# EAGLE design YonderDeep (EAGLE 9.3.2)

## Sheet 1 of 4
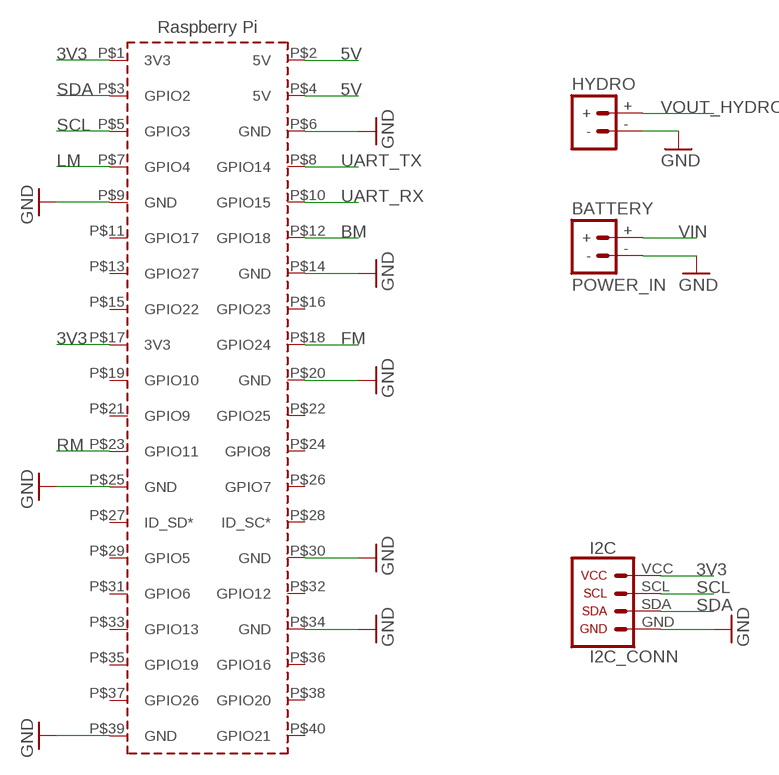
[diagram p0: schematic, sheet 1]

### Parts
BATTERY  POWER_IN  [TERMINAL]
HYDRO  POWER_IN  [TERMINAL]
I2C  I2C_CONN  [1X04]
PCB1  RPI3  [RPI3_CONN_ONLY]

### Nets
3V3: I2C.VCC PCB1.P$1(3V3) PCB1.P$17(3V3) ; also sheet 3
5V: PCB1.P$2(5V) PCB1.P$4(5V) ; also sheet 3,4
BM: PCB1.P$12(GPIO18) ; also sheet 2
FM: PCB1.P$18(GPIO24) ; also sheet 2
GND: BATTERY.- HYDRO.- I2C.GND PCB1.P$6(GND) PCB1.P$9(GND) PCB1.P$14(GND) PCB1.P$20(GND) PCB1.P$25(GND) PCB1.P$30(GND) PCB1.P$34(GND) PCB1.P$39(GND) ; also sheet 2,3,4
LM: PCB1.P$7(GPIO4) ; also sheet 2
RM: PCB1.P$23(GPIO11) ; also sheet 2
SCL: I2C.SCL PCB1.P$5(GPIO3) ; also sheet 3
SDA: I2C.SDA PCB1.P$3(GPIO2) ; also sheet 3
UART_RX: PCB1.P$10(GPIO15) ; also sheet 3
UART_TX: PCB1.P$8(GPIO14) ; also sheet 3
VIN: BATTERY.+ ; also sheet 4
VOUT_HYDRO: HYDRO.+ ; also sheet 4
Unconnected: PCB1.P$11(GPIO17) PCB1.P$13(GPIO27) PCB1.P$15(GPIO22) PCB1.P$16(GPIO23) PCB1.P$19(GPIO10) PCB1.P$21(GPIO9) PCB1.P$22(GPIO25) PCB1.P$24(GPIO8) PCB1.P$26(GPIO7) PCB1.P$27(ID_SD*) PCB1.P$28(ID_SC*) PCB1.P$29(GPIO5) PCB1.P$31(GPIO6) PCB1.P$32(GPIO12) PCB1.P$33(GPIO13) PCB1.P$35(GPIO19) PCB1.P$36(GPIO16) PCB1.P$37(GPIO26) PCB1.P$38(GPIO20) PCB1.P$40(GPIO21)

## Sheet 2 of 4
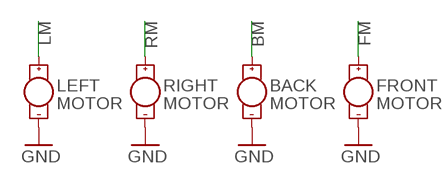
[diagram p1: schematic, sheet 2]

### Parts
BACK  MOTOR  [1X02_PLUS_MINUS]
FRONT  MOTOR  [1X02_PLUS_MINUS]
LEFT  MOTOR  [1X02_PLUS_MINUS]
RIGHT  MOTOR  [1X02_PLUS_MINUS]

### Nets
BM: BACK.+ ; also sheet 1
FM: FRONT.+ ; also sheet 1
GND: BACK.- FRONT.- LEFT.- RIGHT.- ; also sheet 1,3,4
LM: LEFT.+ ; also sheet 1
RM: RIGHT.+ ; also sheet 1

## Sheet 3 of 4
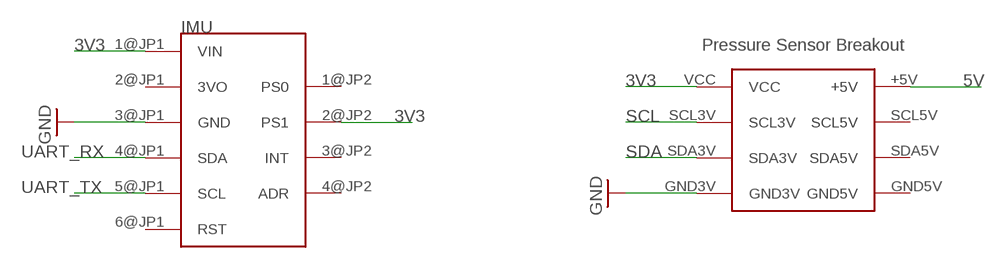
[diagram p2: schematic, sheet 3]

### Parts
IMU  BNO055  [BNO055]
U$1  PRESSURE_SENSOR_BREAKOUT  [BLUEROBOTICS_I2C_LVL_SHFT]

### Nets
3V3: IMU.1@JP1(VIN) IMU.2@JP2(PS1) U$1.VCC ; also sheet 1
5V: U$1.+5V ; also sheet 1,4
GND: IMU.3@JP1(GND) U$1.GND3V ; also sheet 1,2,4
SCL: U$1.SCL3V ; also sheet 1
SDA: U$1.SDA3V ; also sheet 1
UART_RX: IMU.4@JP1(SDA) ; also sheet 1
UART_TX: IMU.5@JP1(SCL) ; also sheet 1
Unconnected: IMU.1@JP2(PS0) IMU.2@JP1(3VO) IMU.3@JP2(INT) IMU.4@JP2(ADR) IMU.6@JP1(RST) U$1.GND5V U$1.SCL5V U$1.SDA5V

## Sheet 4 of 4
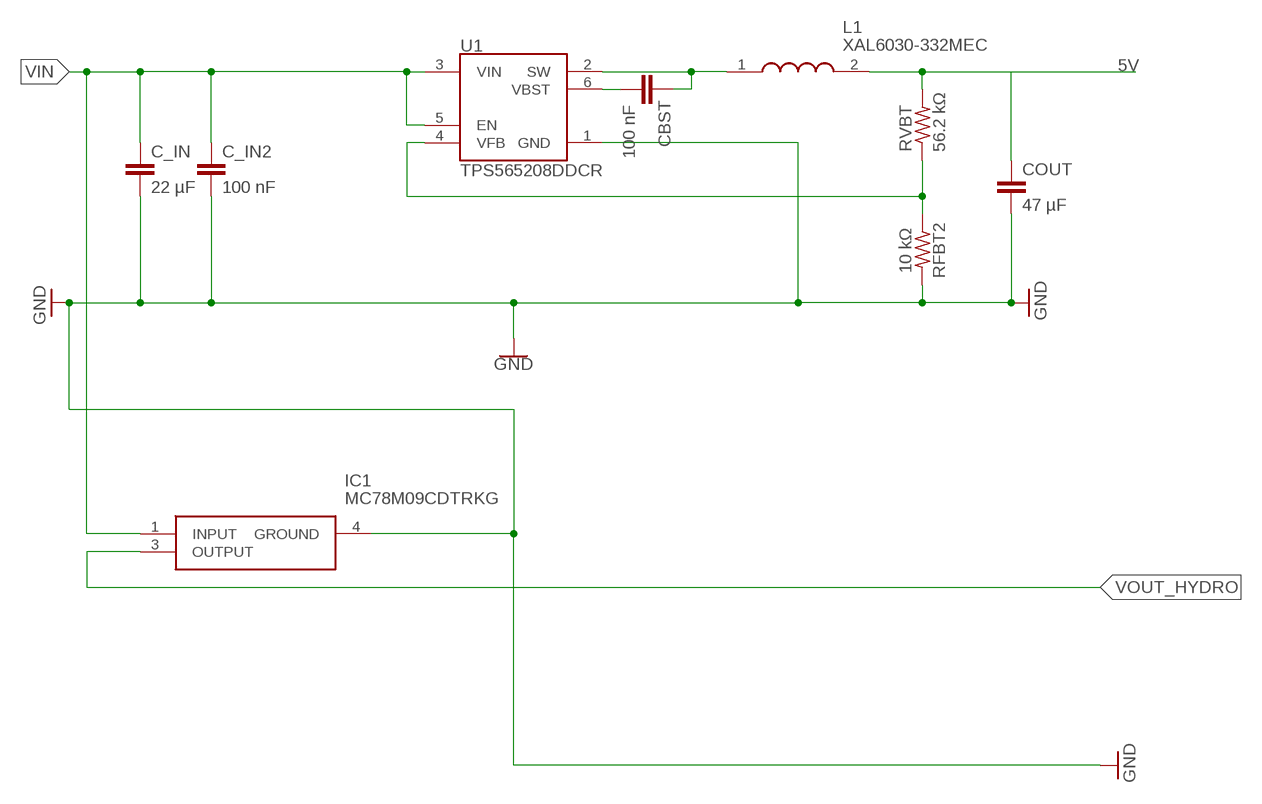
[diagram p3: schematic, sheet 4]

### Parts
C_IN  22 µF  C3216JB1V226M160AC  [C1206K]
C_IN2  100 nF  C0603C104Z3VACTU  [C0603K]
CBST  100 nF  C0603C104Z3VACTU  [C0603K]
COUT  47 µF  TMK325ABJ476MM-P  [C1210K]
IC1  MC78M09CDTRKG  [TO229P991X238-4_3N]
L1  XAL6030-332MEC  [XAL6030-122MEB]
RFBT2  10 kΩ  RMCF0402FT10K0  [RESC1005X40]
RVBT  56.2 kΩ  AC0402FR-0756K2L  [R0402]
U1  TPS565208DDCR  [SOT95P280X110-6N]

### Nets
5V: COUT.1 L1.2 RVBT.2 ; also sheet 1,3
GND: C_IN2.2 C_IN.2 COUT.2 IC1.4(GROUND) RFBT2.2 U1.1(GND) ; also sheet 1,2,3
N$1: CBST.2 U1.6(VBST)
N$2: CBST.1 L1.1 U1.2(SW)
N$3: RFBT2.1 RVBT.1 U1.4(VFB)
VIN: C_IN2.1 C_IN.1 IC1.1(INPUT) U1.3(VIN) U1.5(EN) ; also sheet 1
VOUT_HYDRO: IC1.3(OUTPUT) ; also sheet 1

## Library data of the parts
BACK FRONT LEFT RIGHT = YonderDeep:MOTOR
BATTERY HYDRO = YonderDeep:POWER_IN
C_IN = Yonder_Deep_Library_Step_Down_Rasp:C3216JB1V226M160AC
C_IN2 CBST = Yonder_Deep_Library_Step_Down_Rasp:C0603C104Z3VACTU
COUT = Yonder_Deep_Library_Step_Down_Rasp:TMK325ABJ476MM-P
I2C = YonderDeep:I2C_CONN
IC1 = SamacSys_Parts:MC78M09CDTRKG: ON Semiconductor MC78M09CDTRKG, Single Linear Voltage Regulator, 700mA 9 V, 3-Pin DPAK Source: Datasheet <http://www.mouser.com/datasheet/2/308/MC78M00-D-88441.pdf>; DESCRIPTION: ON Semiconductor MC78M09CDTRKG, Single Linear Voltage Regulator, 700mA 9 V, 3-Pin DPAK; HEIGHT: mm; MANUFACTURER_NAME: ON Semiconductor; MANUFACTURER_PART_NUMBER: MC78M09CDTRKG; MOUSER_PART_NUMBER: 863-MC78M09CDTRKG; MOUSER_PRICE-STOCK: https://www.mouser.com/Search/Refine.aspx?Keyword=863-MC78M09CDTRKG
IMU = YonderDeep:BNO055: BNO055 9-axis Absolute Orientation Sensor ( SiP ) w/Sensors and Sensor Fusion
L1 = Yonder_Deep_Library_Step_Down_Rasp:XAL6030-332MEC: COILCRAFT - XAL6030-332MEC - INDUCTOR, PWR, 3.3UH, 8A, 20%, 26MHZ Source: Datasheet <https://www.coilcraft.com/pdfs/xal60xx.pdf>; DESCRIPTION: COILCRAFT - XAL6030-332MEC - INDUCTOR, PWR, 3.3UH, 8A, 20%, 26MHZ; HEIGHT: mm; MANUFACTURER_NAME: COILCRAFT; MANUFACTURER_PART_NUMBER: XAL6030-332MEC; MOUSER_PART_NUMBER: 994-XAL6030-332MEC; MOUSER_PRICE-STOCK: https://www.mouser.com/Search/Refine.aspx?Keyword=994-XAL6030-332MEC
PCB1 = YonderDeep:RPI3: Device for Raspberry Pi 3 board created by Dave Young for www.element14.com More information and support community is available at https://www.element14.com/community/community/raspberry-pi Device for Raspberry Pi 3 board updated by Gerald Schwarz for www.element14.com On RPI3 addet the layer milling and created a mirrored shield.
RFBT2 = Yonder_Deep_Library_Step_Down_Rasp:RMCF0402FT10K0: RES SMD 10K OHM 1% 1/16W 0402; AVAILABILITY: Unavailable; DESCRIPTION: RMCF Series 0402 0.063 W 10 kOhm ±1 % ±100 ppm/°C SMT Thick Film Chip Resistor; MF: Stackpole Electronics; MP: RMCF0402FT10K0; PACKAGE: 0402 Stackpole Electronics; PRICE: None
RVBT = Yonder_Deep_Library_Step_Down_Rasp:AC0402FR-0756K2L
U1 = Yonder_Deep_Library_Step_Down_Rasp:TPS565208DDCR: 4.5V to 17V, 5A Synchronous Step-Down Voltage Regulator in SOT23 6-SOT-23-THIN -40 to 125; AVAILABILITY: Unavailable; DESCRIPTION: 4.5V to 17V, 5A Synchronous Step-Down Voltage Regulator in SOT23 6-SOT-23-THIN -40 to 125; MF: Texas Instruments; MP: TPS565208DDCR; PACKAGE: SOT-23 Texas Instruments; PRICE: None
U$1 = YonderDeep:PRESSURE_SENSOR_BREAKOUT

## Board
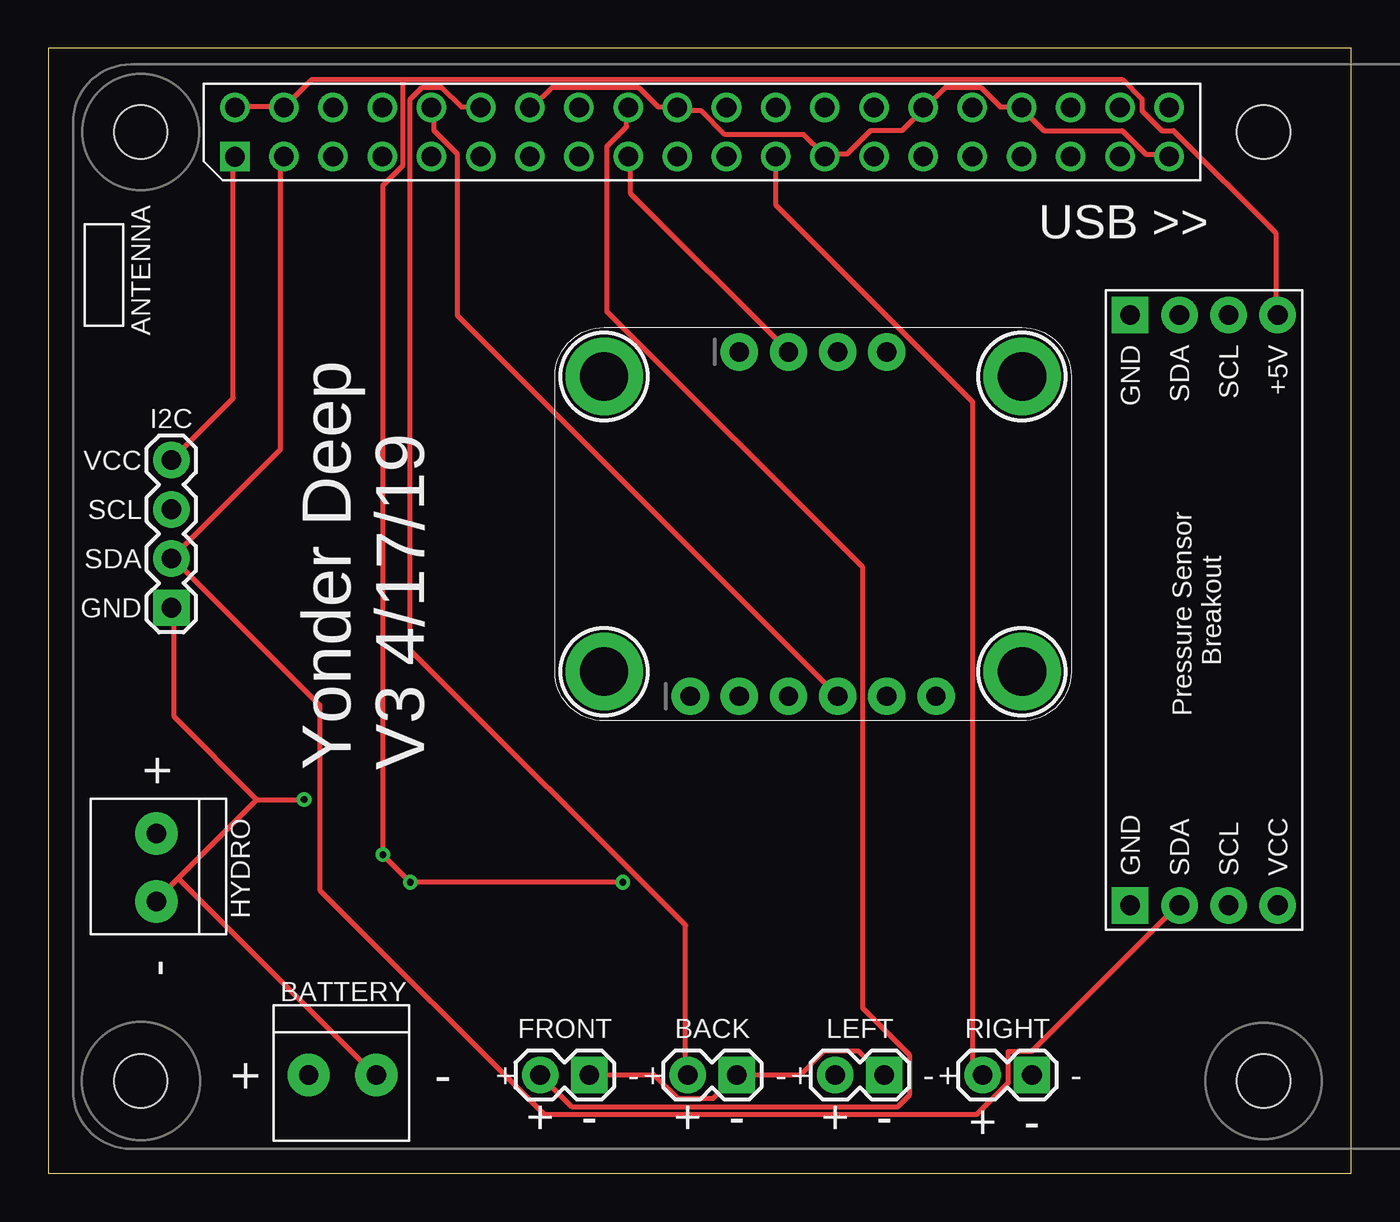
[diagram p4: board, top side]
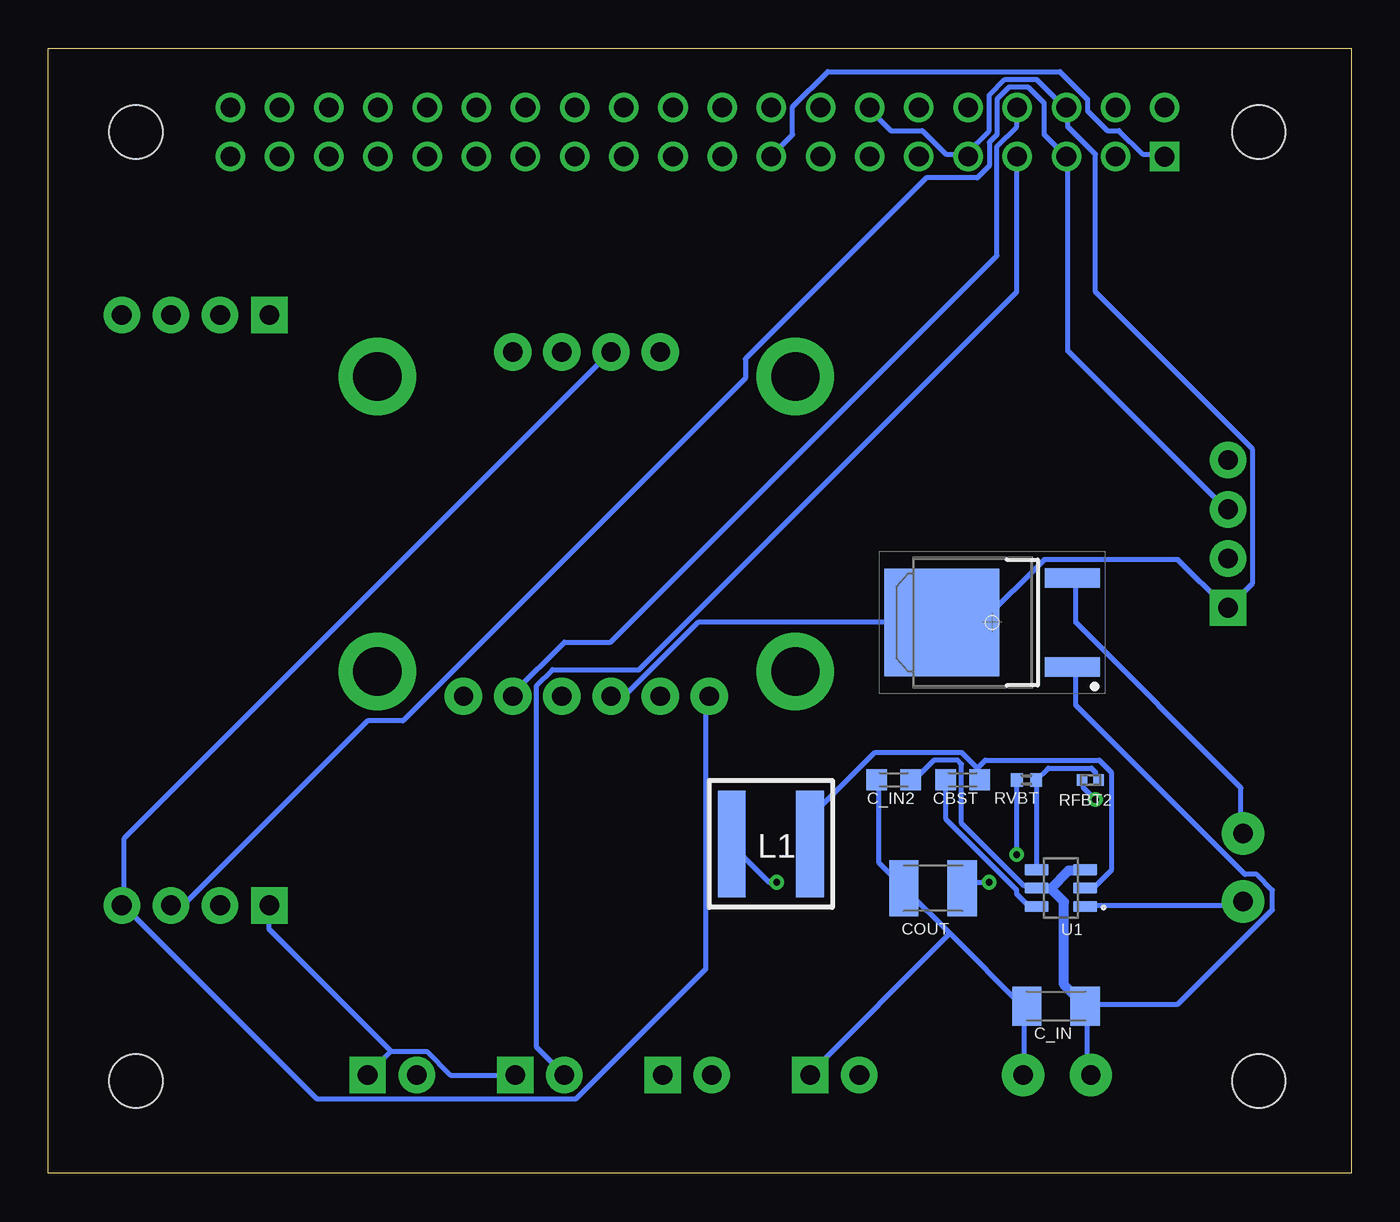
[diagram p5: board, bottom side, seen from below]

Size 67.29 x 58.09 mm. Coordinates in mm from the lower left corner, seen from the top.
Outline: 0,0 67.29,0 67.29,58.09 0,58.09 0,0
Copper layers (1*16): Top 0.035mm / dielectric 1.5mm / Bottom 0.035mm
Design rules "default *": minimum track width 10mil, minimum drill 0.35mm, track to track 6mil, track to pad 6mil, pad to pad 6mil, via to via 6mil, smd to smd 6mil, copper to edge 40mil, drill to drill 6mil, minimum pad ring 10mil, minimum via ring 8mil, stop-mask expansion 4mil, vias tented up to drill 20mil, thermal gap 10mil

### Footprints (pad centres in the part's own frame; a part is rotated, then mirrored left to right if it is on the bottom)
1X02_PLUS_MINUS = drill 1.016 pad 1.88: + 0,0 | drill 1.016 pad 1.88 square: - 2.54,0
TERMINAL = drill 1 pad 2.184: + -1.8,0; - 1.7,0
C1206K = smd 1.5 x 2: 1 -1.5,0; 2 1.5,0
C0603K = smd 1.05 x 1.08: 1 -0.875,0; 2 0.875,0
C1210K = smd 1.5 x 2.9: 1 -1.5,0; 2 1.5,0
1X04 = drill 1.016 pad 1.88 square: GND 0,3.81 | drill 1.016 pad 1.88: SCL 0,-1.27; SDA 0,1.27; VCC 0,-3.81
TO229P991X238-4_3N = smd 2.85 x 1: 1 -4.15,2.29; 3 -4.15,-2.29 | smd 5.95 x 5.55: 4 2.6,0
BNO055 = drill 1 pad 1.93: 1@JP1 6.985,1.27; 1@JP2 9.525,19.05; 2@JP1 9.525,1.27; 2@JP2 12.065,19.05; 3@JP1 12.065,1.27; 3@JP2 14.605,19.05; 4@JP1 14.605,1.27; 4@JP2 17.145,19.05; 5@JP1 17.145,1.27; 6@JP1 19.685,1.27 | drill 2.5 pad 4: P$1@U$29 2.54,17.78; P$1@U$30 2.54,2.54; P$1@U$31 24.13,17.78; P$1@U$32 24.13,2.54
XAL6030-122MEB = smd 1.43 x 5.5: 1 -2.02,0; 2 2.02,0
RPI3_CONN_ONLY = drill 1.016 square: P$1 8.37,51.23 | drill 1.016: P$2 8.357,53.772; P$3 10.897,51.232; P$4 10.897,53.772; P$5 13.437,51.232; P$6 13.437,53.772; P$7 15.977,51.232; P$8 15.977,53.772; P$9 18.517,51.232; P$10 18.517,53.772; P$11 21.057,51.232; P$12 21.057,53.772; P$13 23.597,51.232; P$14 23.597,53.772; P$15 26.137,51.232; P$16 26.137,53.772; P$17 28.677,51.232; P$18 28.677,53.772; P$19 31.217,51.232; P$20 31.217,53.772; P$21 33.757,51.232; P$22 33.757,53.772; P$23 36.297,51.232; P$24 36.297,53.772; P$25 38.837,51.232; P$26 38.837,53.772; P$27 41.377,51.232; P$28 41.377,53.772; P$29 43.917,51.232; P$30 43.917,53.772; P$31 46.457,51.232; P$32 46.457,53.772; P$33 48.997,51.232; P$34 48.997,53.772; P$35 51.537,51.232; P$36 51.537,53.772; P$37 54.077,51.232; P$38 54.077,53.772; P$39 56.617,51.232; P$40 56.617,53.772 | hole 2.75: 3.5,3.5; 61.5,3.5; 3.5,52.5; 61.5,52.5
RESC1005X40 = smd 0.54 x 0.6: 1 -0.43,0; 2 0.43,0
R0402 = smd 0.6 x 0.7: 1 -0.5,0; 2 0.5,0
SOT95P280X110-6N = smd 1.25 x 0.59: 1 -1.255,0.95; 2 -1.255,0; 3 -1.255,-0.95; 4 1.255,-0.95; 5 1.255,0; 6 1.255,0.95
BLUEROBOTICS_I2C_LVL_SHFT = drill 1.016 pad 1.88: +5V 0,3.81; SCL3V 30.48,1.27; SCL5V 0,1.27; SDA3V 30.48,-1.27; SDA5V 0,-1.27; VCC 30.48,3.81 | drill 1.016 pad 1.88 square: GND3V 30.48,-3.81; GND5V 0,-3.81

### Placement (x,y rotation side)
BACK  33.02,5.08 0 top
BATTERY  15.24,5.08 0 top
C_IN  15.24,8.64 180 bottom
C_IN2  23.62,20.32 180 bottom
CBST  20.07,20.32 180 bottom
COUT  21.59,14.73 180 bottom
FRONT  25.4,5.08 0 top
HYDRO  5.59,15.75 270 top
I2C  6.35,33.02 180 top
IC1  18.54,28.45 180 bottom
IMU  26.16,23.37 0 top
L1  29.97,17.02 180 bottom
LEFT  40.64,5.08 0 top
PCB1  1.27,1.27 0 top
RFBT2  13.46,20.32 180 bottom
RIGHT  48.26,5.08 0 top
RVBT  16.76,20.32 180 bottom
U1  14.99,14.73 180 bottom
U$1  59.69,44.32 270 top

### Tracks (layer width: path | path; a pad name or v marks a point on that pad's centre or on a via)
3V3
  Top 0.254: I2C.VCC 9.55,40.03 9.55,52.43 PCB1.P$1 | PCB1.P$17 30.07,52.43 30.07,50.6 38.2,42.47 IMU.2@JP2
  Bottom 0.254: IMU.2@JP2 38.41,42.27 63.4,17.27 63.4,14.02 U$1.VCC 63.4,13.82 53.44,3.86 40.03,3.86 33.33,10.57 33.33,24.59 IMU.1@JP1 | PCB1.P$1 9.75,52.63 10.77,52.63 11.99,53.85 12.6,53.85 13.61,54.86 13.61,55.47 15.04,56.9 27.03,56.9 28.85,55.07 28.85,53.65 29.87,52.63 PCB1.P$17
5V  (via drill 0.35)
  Top 0.254: v29.67,15.04 v18.69,15.04 v17.27,16.46 17.27,51 18.29,52.02 18.29,56.49 | PCB1.P$2 9.75,55.07 11.99,55.07 PCB1.P$4 13.61,56.49 18.29,56.49 | 18.29,56.49 55.47,56.49 56.49,55.47 56.49,54.86 57.51,53.85 58.12,53.85 63.4,48.56 63.4,44.5 U$1.+5V
  Bottom 0.254: v17.27,16.46 17.27,20.32 RVBT.2 | v18.69,15.04 19.71,15.04 19.91,14.83 COUT.1 | v29.67,15.04 30.07,15.04 31.9,16.87 L1.2
BM
  Top 0.254: PCB1.P$12 22.15,55.07 21.34,55.07 20.32,56.08 19.3,56.08 18.69,55.47 18.69,27.03 32.92,12.8 32.92,5.08 BACK.+
FM
  Top 0.254: FRONT.+ 27.03,3.45 43.89,3.45 44.5,4.06 44.5,6.1 42.06,8.53 42.06,31.29 28.85,44.5 28.85,53.03 29.87,54.05 29.87,54.86 PCB1.P$18
GND  (via drill 0.35)
  Top 0.254: PCB1.P$14 24.99,55.07 26.01,56.08 30.48,56.08 31.5,55.07 32.31,55.07 PCB1.P$20 32.51,54.86 33.73,54.86 34.95,53.65 39.01,53.65 40.03,52.63 PCB1.P$25 40.23,52.63 41.25,52.63 42.47,53.85 44.09,53.85 45.11,54.86 PCB1.P$30 45.31,55.07 46.33,56.08 48.16,56.08 49.17,55.07 50.19,55.07 PCB1.P$34 50.39,54.86 51.41,53.85 55.47,53.85 56.69,52.63 57.71,52.63 PCB1.P$39 | 10.77,19.3 v13.21,19.3 | 6.71,15.24 5.69,14.22 HYDRO.- | 6.71,15.24 10.77,19.3 | 10.77,19.3 6.5,23.57 6.5,29.06 I2C.GND | FRONT.- 31.29,5.08 32.51,3.86 34.34,3.86 BACK.- 38.81,5.08 40.03,6.3 41.86,6.3 43.08,5.08 LEFT.- | 6.71,15.24 16.87,5.08 BATTERY.-
  Bottom 0.254: 19.91,52.63 20.93,52.63 22.15,53.85 23.77,53.85 24.79,54.86 PCB1.P$14 | 19.91,52.63 18.69,53.85 18.69,55.68 17.88,56.49 16.26,56.49 14.83,55.07 PCB1.P$6 14.63,54.86 14.63,54.05 13.21,52.63 13.21,45.52 5.08,37.39 5.08,30.48 I2C.GND 6.5,29.26 8.94,31.7 15.85,31.7 19.1,28.45 IC1.4 33.73,28.45 37.39,24.79 38.2,24.79 IMU.3@JP1 | 19.91,52.63 PCB1.P$9 | v13.21,19.3 13.82,19.91 13.82,20.32 RFBT2.2 | U1.1 13.61,13.82 5.89,13.82 5.69,14.02 HYDRO.- | C_IN2.2 24.38,20.32 24.38,16.05 23.16,14.83 COUT.2 22.96,14.63 20.73,12.39 | 16.87,8.53 16.87,5.08 BATTERY.- | 16.87,8.53 20.73,12.39 | 16.87,8.53 C_IN.2 | LEFT.- 46.53,5.08 47.75,6.3 49.58,6.3 | RIGHT.- 49.58,6.3 | U$1.GND3V 55.88,12.6 49.58,6.3 | 20.73,12.39 28.04,5.08 FRONT.-
LM
  Bottom 0.254: LEFT.+ 42.06,6.5 42.06,25.2 41.25,26.01 36.78,26.01 17.27,45.52 17.27,52.43 PCB1.P$7
N$1
  Bottom 0.254: CBST.2 20.93,18.29 17.27,14.63 17.27,14.43 16.66,13.82 16.26,13.82 U1.6
N$2
  Bottom 0.254: 19.3,20.93 19.3,20.32 CBST.1 | 19.3,20.93 20.12,21.74 24.59,21.74 27.84,18.49 27.84,17.07 L1.1 | 19.3,20.93 18.9,21.34 13.01,21.34 12.39,20.73 12.39,15.65 13.21,14.83 13.61,14.83 U1.2
N$3
  Bottom 0.254: RVBT.1 15.65,20.93 13.41,20.93 13.21,20.73 13.21,20.32 RFBT2.1 | RVBT.1 16.26,15.85 U1.4 | RVBT.1
RM
  Top 0.254: PCB1.P$23 37.59,52.43 37.59,49.99 47.75,39.83 47.75,5.49 48.16,5.08 RIGHT.+
SCL
  Bottom 0.254: I2C.SCL 6.5,34.34 14.63,42.47 14.63,52.43 PCB1.P$5 15.85,53.65 15.85,55.27 16.66,56.08 17.68,56.08 18.29,55.47 18.29,53.65 18.69,53.24 18.69,52.02 19.3,51.41 21.95,51.41 31.29,42.06 31.29,41.05 48.97,23.37 50.8,23.37 60.15,14.02 60.96,14.02 U$1.SCL3V
SDA
  Top 0.254: PCB1.P$3 11.99,52.43 11.99,37.39 I2C.SDA 6.5,31.7 14.02,24.18 14.02,14.63 25.6,3.05 47.95,3.05 49.58,4.67 49.58,6.3 50.8,6.3 58.32,13.82 U$1.SDA3V
UART_RX
  Top 0.254: PCB1.P$10 19.91,54.86 19.91,53.85 21.13,52.63 21.13,44.3 40.64,24.79 IMU.4@JP1
UART_TX
  Bottom 0.254: PCB1.P$8 17.27,54.86 17.27,54.05 18.29,53.03 18.29,47.4 38.25,27.43 40.64,27.43 43.28,24.79 IMU.5@JP1
VIN
  Bottom 0.254: C_IN2.1 22.55,20.32 21.54,21.34 20.32,21.34 20.12,21.13 20.12,18.09 16.87,14.83 16.26,14.83 U1.5 | 13.82,15.65 U1.3 | C_IN.1 13.61,8.53 13.61,5.08 BATTERY.+ | IC1.1 14.22,26.01 14.22,24.18 5.49,15.44 4.88,15.44 4.06,14.63 4.06,13.61 8.94,8.74 13.61,8.74 C_IN.1 | 13.82,8.74 C_IN.1
  Bottom 0.508: 13.82,15.65 14.58,15.65 15.52,14.71 | 15.52,14.71 14.83,14.02 14.83,9.75 13.82,8.74 | 15.52,14.71 16.22,14.71 U1.5
VOUT_HYDRO
  Bottom 0.254: IC1.3 14.22,30.68 14.22,28.45 5.69,19.91 5.69,17.68 HYDRO.+

### Text on the board
tPlace: Yonder Deep / V3 4/17/19 | + | - | + | - | + | - | + | -